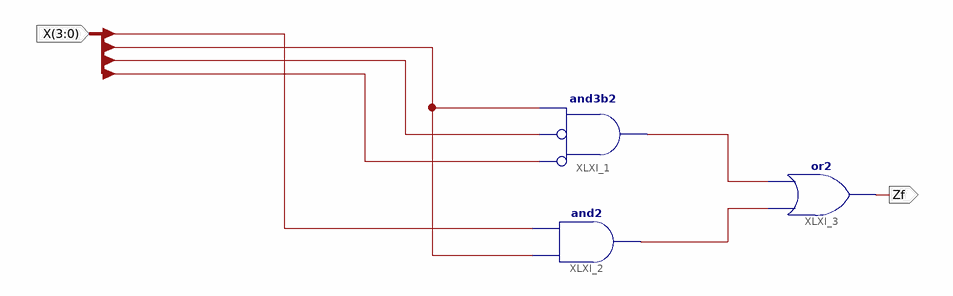
[diagram p0: schematic sheet 1]
// Xilinx ISE schematic f.sch (spartan3e) as structural Verilog: 3 symbols, 2 ports
module f (
  input  [3:0] X,
  output Zf
);

  wire XLXN_16, XLXN_17;

  and XLXI_1 (XLXN_16, ~X[3], ~X[2], X[1]);  // and3b2
  and XLXI_2 (XLXN_17, X[1], X[0]);
  or XLXI_3 (Zf, XLXN_17, XLXN_16);
endmodule
